# EAGLE design esquema (EAGLE 5.09)
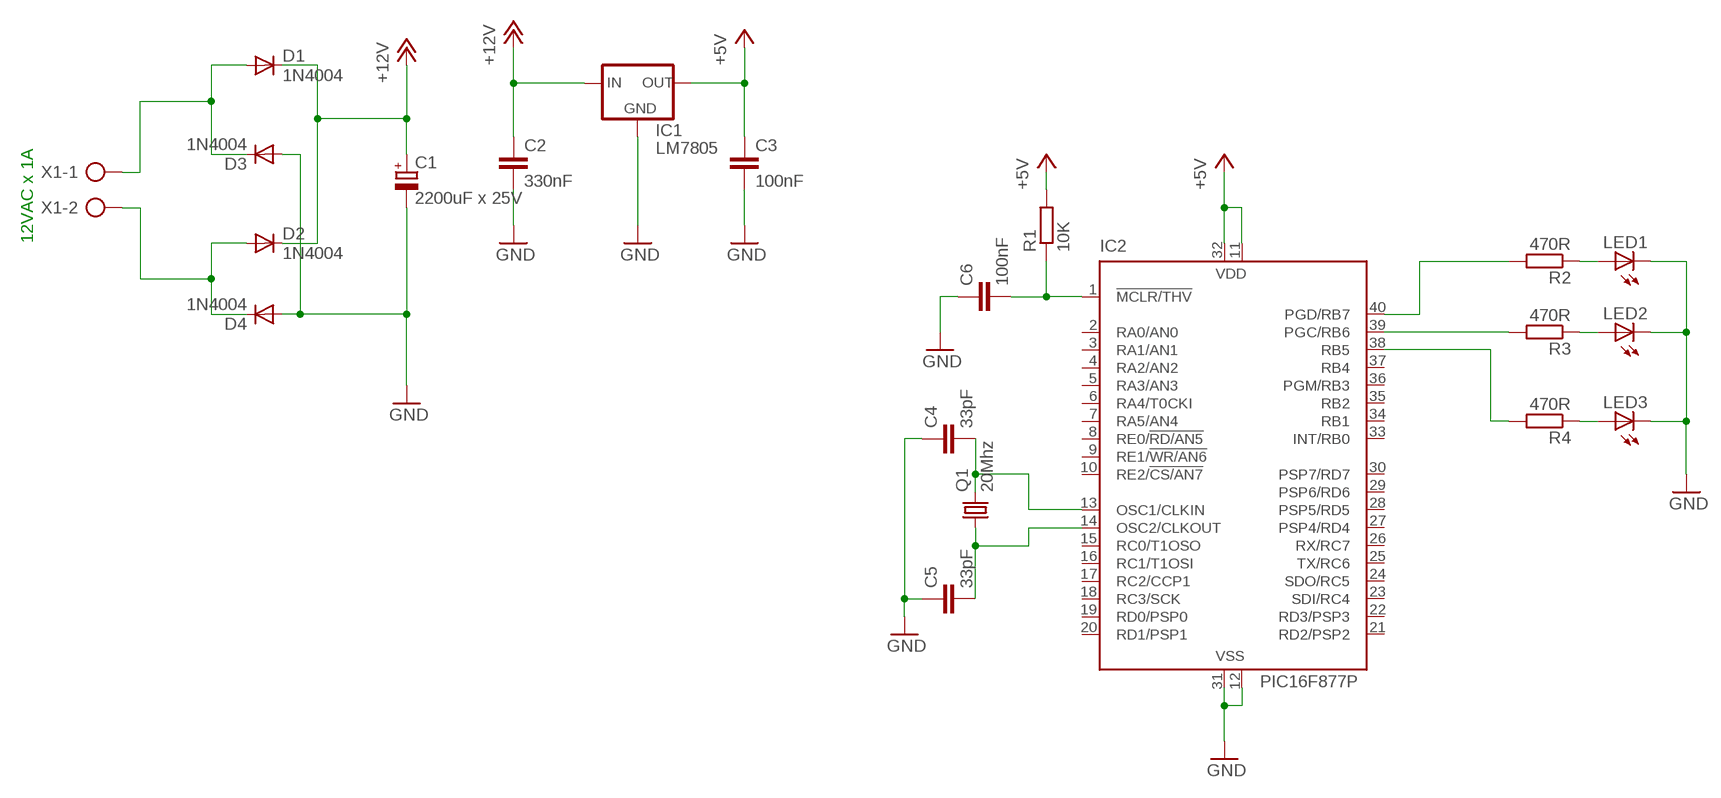
[diagram p0: schematic, sheet 1]

## Parts
C1  2200uF x 25V  CPOL-EUE7.5-16  [E7,5-16]
C2  330nF  C-EU050-030X075  [C050-030X075]
C3  100nF  C-EU050-030X075  [C050-030X075]
C4  33pF  C-EU050-030X075  [C050-030X075]
C5  33pF  C-EU050-030X075  [C050-030X075]
C6  100nF  C-EU050-030X075  [C050-030X075]
D1  1N4004  [DO41-10]
D2  1N4004  [DO41-10]
D3  1N4004  [DO41-10]
D4  1N4004  [DO41-10]
IC1  LM7805  78XXL  [78XXL]
IC2  PIC16F877P  [DIL40]
LED1  LEDB152  [Q62902-B152]
LED2  LEDB152  [Q62902-B152]
LED3  LEDB152  [Q62902-B152]
Q1  20Mhz  CRYSTALHC49S  [HC49/S]
R1  10K  R-EU_0207/10  [0207/10]
R2  470R  R-EU_0207/10  [0207/10]
R3  470R  R-EU_0207/10  [0207/10]
R4  470R  R-EU_0207/10  [0207/10]
X1  AK300/2  [AK300/2]

## Nets
+5V: C3.1 IC1.OUT IC2.11(VDD) IC2.32(VDD) R1.2
+12V: C1.+ C2.1 D1.C D2.C IC1.IN
GND: C1.- C2.2 C3.2 C4.1 C5.1 C6.1 D3.A D4.A IC1.GND IC2.12(VSS) IC2.31(VSS) LED1.K(C) LED2.K(C) LED3.K(C)
N$1: D1.A D3.C X1.1
N$2: D2.A D4.C X1.2
N$4: C6.2 IC2.1(!MCLR/THV) R1.1
N$5: C4.2 IC2.13(OSC1/CLKIN) Q1.2
N$6: C5.2 IC2.14(OSC2/CLKOUT) Q1.1
N$7: LED3.A R4.1
N$8: LED2.A R3.1
N$9: LED1.A R2.1
N$11: IC2.40(PGD/RB7) R2.2
N$12: IC2.39(PGC/RB6) R3.2
N$13: IC2.38(RB5) R4.2
Unconnected: IC2.2(RA0/AN0) IC2.3(RA1/AN1) IC2.4(RA2/AN2) IC2.5(RA3/AN3) IC2.6(RA4/T0CKI) IC2.7(RA5/AN4) IC2.8(RE0/!RD/AN5) IC2.9(RE1/!WR/AN6) IC2.10(RE2/!CS/AN7) IC2.15(RC0/T1OSO) IC2.16(RC1/T1OSI) IC2.17(RC2/CCP1) IC2.18(RC3/SCK) IC2.19(RD0/PSP0) IC2.20(RD1/PSP1) IC2.21(RD2/PSP2) IC2.22(RD3/PSP3) IC2.23(SDI/RC4) IC2.24(SDO/RC5) IC2.25(TX/RC6) IC2.26(RX/RC7) IC2.27(PSP4/RD4) IC2.28(PSP5/RD5) IC2.29(PSP6/RD6) IC2.30(PSP7/RD7) IC2.33(INT/RB0) IC2.34(RB1) IC2.35(RB2) IC2.36(PGM/RB3) IC2.37(RB4)

## Notes on the sheet
- 12VAC x 1A

## Library data of the parts
C1 = rcl:CPOL-EU: POLARIZED CAPACITOR, European symbol
C2-C6 = rcl:C-EU: CAPACITOR, European symbol
D1-D4 = diode:1N4004: DIODE general purpose rectifier, 1 A
IC1 = v-reg:78XXL: VOLTAGE REGULATOR
IC2 = microchip:PIC16F87*: MICROCONTROLLER
LED1-LED3 = led:LED: LED OSRAM: - CHIPLED LG R971, LG N971, LY N971, LG Q971, LY Q971, LO R971, LY R971 LH N974, LH R974 LS Q976, LO Q976, LY Q976 LO Q996 - Hyper CHIPLED LW Q18S LB Q993, LB Q99A, LB R99A - SideLED LS A670, LO A670, LY A670, LG A670, LP A670 LB A673, LV A673, LT A673, LW A673 LH A674 LY A675 LS A676, LA A676, LO A676, LY A676, LW A676 LS A679, LY A679, LG A679 - Hyper Micro SIDELED® LS Y876, LA Y876, LO Y876, LY Y876 LT Y87S - SmartLED LW L88C, LW L88S LB L89C, LB L89S, LG L890 LS L89K, LO L89K, LY L89K LS L896, LA L896, LO L896, LY L896 - TOPLED LS T670, LO T670, LY T670, LG T670, LP T670 LSG T670, LSP T670, LSY T670, LOP T670, LYG T670 LG T671, LOG T671, LSG T671 LB T673, LV T673, LT T673, LW T673 LH T674 LS T676, LA T676, LO T676, LY T676, LB T676, LH T676, LSB T676, LW T676 LB T67C, LV T67C, LT T67C, LS T67K, LO T67K, LY T67K, LW E67C LS E67B, LA E67B, LO E67B, LY E67B, LB E67C, LV E67C, LT E67C LW T67C LS T679, LY T679, LG T679 LS T770, LO T770, LY T770, LG T770, LP T770 LB T773, LV T773, LT T773, LW T773 LH T774 LS E675, LA E675, LY E675, LS T675 LS T776, LA T776, LO T776, LY T776, LB T776 LHGB T686 LT T68C, LB T68C - Hyper Mini TOPLED® LB M676 - Mini TOPLED Santana® LG M470 LS M47K, LO M47K, LY M47K Source: http://www.osram.convergy.de LUXEON: - LUMILED® LXK2-PW12-R00, LXK2-PW12-S00, LXK2-PW14-U00, LXK2-PW14-V00 LXK2-PM12-R00, LXK2-PM12-S00, LXK2-PM14-U00 LXK2-PE12-Q00, LXK2-PE12-R00, LXK2-PE12-S00, LXK2-PE14-T00, LXK2-PE14-U00 LXK2-PB12-K00, LXK2-PB12-L00, LXK2-PB12-M00, LXK2-PB14-N00, LXK2-PB14-P00, LXK2-PB14-Q00 LXK2-PR12-L00, LXK2-PR12-M00, LXK2-PR14-Q00, LXK2-PR14-R00 LXK2-PD12-Q00, LXK2-PD12-R00, LXK2-PD12-S00 LXK2-PH12-R00, LXK2-PH12-S00 LXK2-PL12-P00, LXK2-PL12-Q00, LXK2-PL12-R00 Source: www.luxeon.com KINGBRIGHT: KA-3528ASYC Source: www.kingbright.com
Q1 = crystal:CRYSTAL: CRYSTAL
R1-R4 = rcl:R-EU_: RESISTOR, European symbol
X1 = con-ptr500:AK300/2: CONNECTOR

## Board
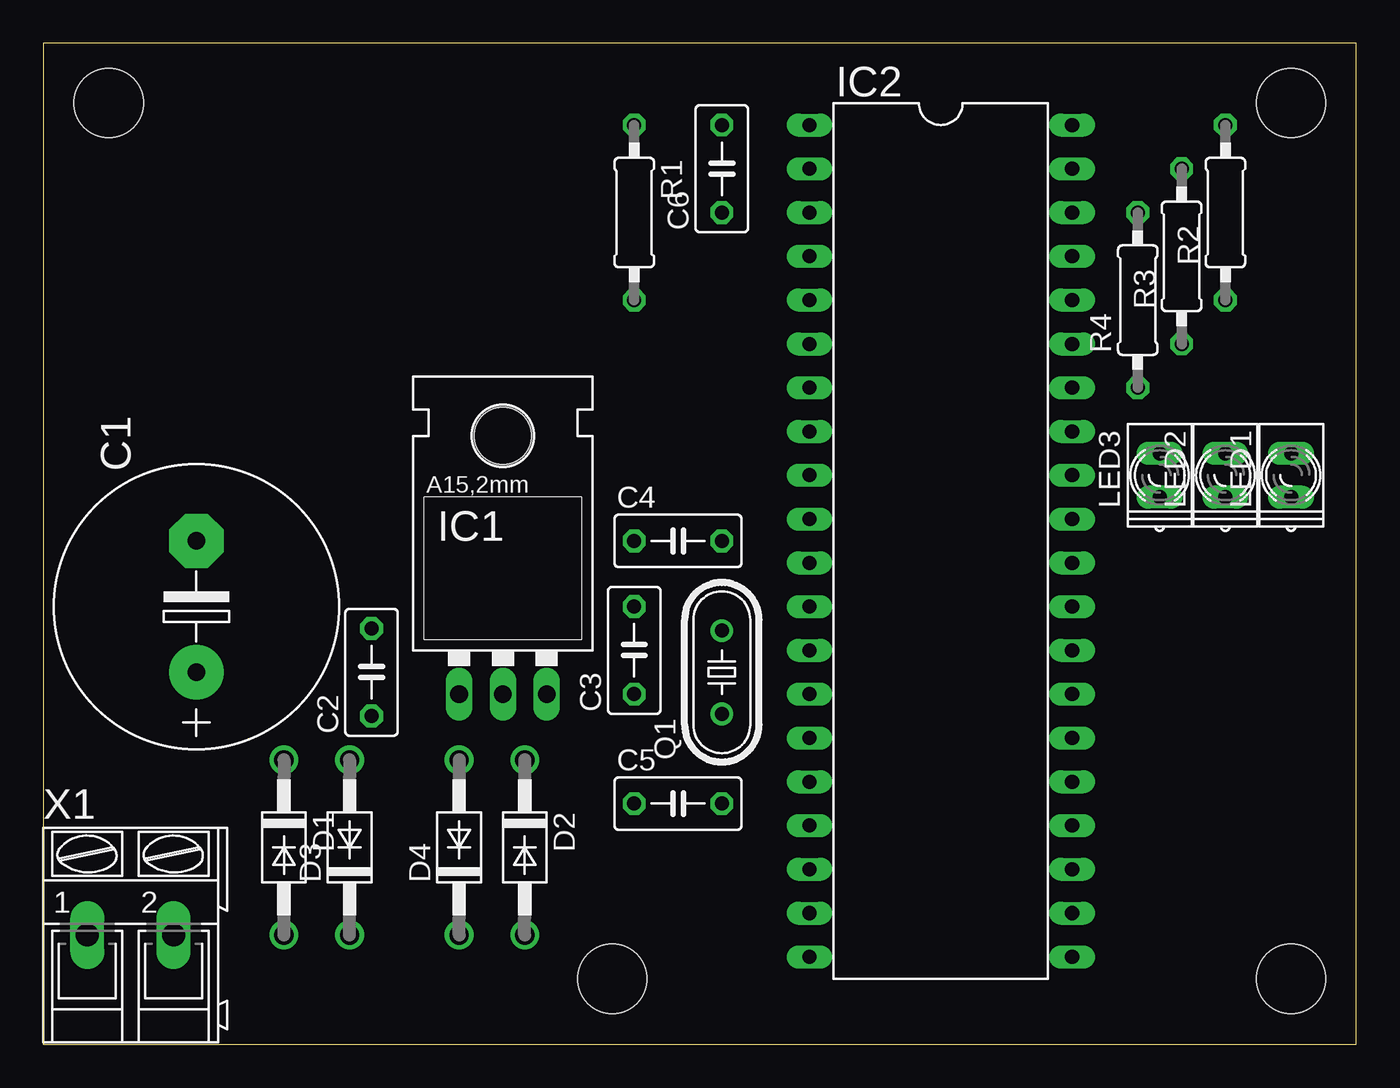
[diagram p1: board, top side]
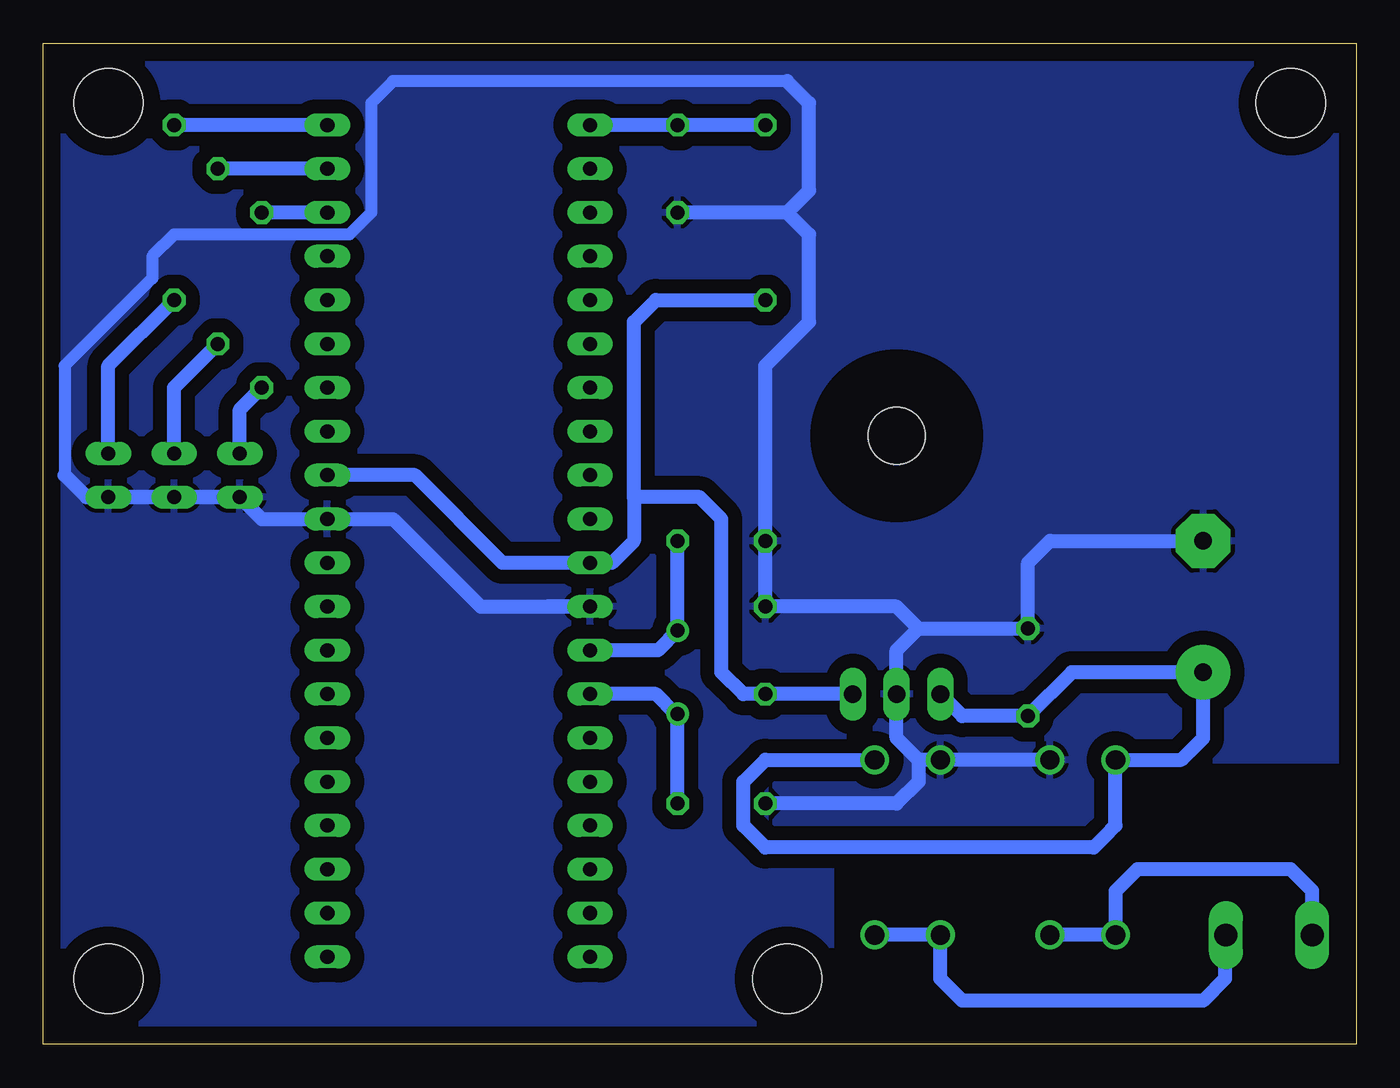
[diagram p2: board, bottom side, seen from below]

Size 76.18 x 58.09 mm. Coordinates in mm from the lower left corner, seen from the top.
Outline: 0,0 76.18,0 76.18,58.09 0,58.09 0,0
Copper layers (1*16): Top 0.035mm / dielectric 1.5mm / Bottom 0.035mm
Design rules "default": minimum track width 10mil, minimum drill 24mil, track to track 8mil, track to pad 8mil, pad to pad 8mil, via to via 8mil, smd to smd 8mil, copper to edge 40mil, drill to drill 8mil, minimum pad ring 10mil, minimum via ring 8mil, stop-mask expansion 4mil, vias tented up to drill 0mil, thermal gap 10mil
Holes 4 mm at 3.81,54.61 72.39,54.61 72.39,3.81 33.02,3.81

### Footprints (pad centres in the part's own frame; a part is rotated, then mirrored left to right if it is on the bottom)
E7,5-16 = drill 1.016 pad 3.15 round: + -3.81,0 | drill 1.016 pad 3.15 octagon: - 3.81,0
C050-030X075 = drill 0.813 octagon: 1 -2.54,0; 2 2.54,0
DO41-10 = drill 1.118 round: A 5.08,0; C -5.08,0
78XXL = drill 1.016 long: GND 0,-3.81; IN -2.54,-3.81; OUT 2.54,-3.81 | hole 3.302: 0,11.176
DIL40 = drill 0.813 long: 1 -24.13,-7.62; 2 -21.59,-7.62; 3 -19.05,-7.62; 4 -16.51,-7.62; 5 -13.97,-7.62; 6 -11.43,-7.62; 7 -8.89,-7.62; 8 -6.35,-7.62; 9 -3.81,-7.62; 10 -1.27,-7.62; 11 1.27,-7.62; 12 3.81,-7.62; 13 6.35,-7.62; 14 8.89,-7.62; 15 11.43,-7.62; 16 13.97,-7.62; 17 16.51,-7.62; 18 19.05,-7.62; 19 21.59,-7.62; 20 24.13,-7.62; 21 24.13,7.62; 22 21.59,7.62; 23 19.05,7.62; 24 16.51,7.62; 25 13.97,7.62; 26 11.43,7.62; 27 8.89,7.62; 28 6.35,7.62; 29 3.81,7.62; 30 1.27,7.62; 31 -1.27,7.62; 32 -3.81,7.62; 33 -6.35,7.62; 34 -8.89,7.62; 35 -11.43,7.62; 36 -13.97,7.62; 37 -16.51,7.62; 38 -19.05,7.62; 39 -21.59,7.62; 40 -24.13,7.62
Q62902-B152 = drill 0.813 long: A 1.27,0; K -1.27,0
HC49/S = drill 0.813 round: 1 -2.413,0; 2 2.413,0
0207/10 = drill 0.813 octagon: 1 -5.08,0; 2 5.08,0
AK300/2 = drill 1.321 long: 1 -2.515,0; 2 2.489,0

### Placement (x,y rotation side)
C1  8.89,25.4 90 top
C2  19.05,21.59 90 top
C3  34.29,22.86 90 top
C4  36.83,29.21 0 top
C5  36.83,13.97 0 top
C6  39.37,50.8 90 top
D1  13.97,11.43 270 top
D2  27.94,11.43 270 top
D3  17.78,11.43 90 top
D4  24.13,11.43 90 top
IC1  26.67,24.13 0 top
IC2  52.07,29.21 270 top
LED1  72.39,33.02 90 top
LED2  68.58,33.02 90 top
LED3  64.77,33.02 90 top
Q1  39.37,21.59 90 top
R1  34.29,48.26 270 top
R2  68.58,48.26 90 top
R3  66.04,45.72 90 top
R4  63.5,43.18 90 top
X1  5.08,6.35 0 top

### Tracks (layer width: path | path; a pad name or v marks a point on that pad's centre or on a via)
+5V
  Bottom 0.813: IC1.OUT C3.1 35.56,20.32 36.83,21.59 36.83,30.48 38.1,31.75 41.91,31.75 | IC2.32 54.61,33.02 49.53,27.94 IC2.11 43.18,27.94 41.91,29.21 41.91,31.75 | 41.91,31.75 41.91,41.91 40.64,43.18 R1.2
+12V
  Bottom 0.813: IC1.IN 22.86,19.05 C2.1 16.51,21.59 C1.+ 8.89,17.78 10.16,16.51 D1.C 13.97,12.7 14.61,12.06 15.24,11.43 34.29,11.43 35.56,12.7 35.56,15.24 34.29,16.51 D2.C
GND
  Bottom 0.7: 33.02,55.88 55.88,55.88 57.15,54.61 57.15,48.26 58.42,46.99 68.58,46.99 69.85,45.72 69.85,44.45 74.93,39.37 74.93,33.02
  Bottom 0.813: D3.A D4.A 25.4,16.51 | 25.4,16.51 26.67,17.78 IC1.GND 26.67,22.86 25.4,24.13 | 25.4,24.13 C2.2 19.05,27.94 17.78,29.21 C1.- | 25.4,24.13 26.67,25.4 C3.2 C4.1 34.29,39.37 31.75,41.91 31.75,46.99 33.02,48.26 | C5.1 26.67,13.97 25.4,15.24 25.4,16.51 | 33.02,48.26 C6.1 | 46.99,25.4 IC2.12 50.8,25.4 55.88,30.48 IC2.31 63.5,30.48 LED3.K | LED3.K LED2.K LED1.K | LED3.K 73.66,31.75 74.93,33.02 | 33.02,55.88 31.75,54.61 31.75,49.53 33.02,48.26
  pour Bottom (isolate 0.813): 76.2,57.15 76.2,0 30.48,0 30.48,11.43 13.97,11.43 13.97,16.51 0,16.51 0,57.15 0,58.42 76.2,58.42
N$1
  Bottom 0.813: D3.C D1.A 13.97,8.89 12.7,10.16 3.81,10.16 2.56,8.91 X1.1
N$2
  Bottom 0.813: X1.2 7.62,6.35 7.62,3.81 8.89,2.54 22.86,2.54 24.13,3.81 D4.C D2.A
N$4
  Bottom 0.813: R1.1 C6.2 IC2.1
N$5
  Bottom 0.813: IC2.13 40.51,22.86 Q1.2 C4.2
N$6
  Bottom 0.813: IC2.14 40.64,20.32 39.5,19.18 Q1.1 C5.2
N$7
  Bottom 0.813: LED3.A 64.77,36.83 R4.1
N$8
  Bottom 0.813: LED2.A 68.58,38.1 R3.1
N$9
  Bottom 0.813: LED1.A 72.39,39.37 R2.1
N$11
  Bottom 0.813: IC2.40 R2.2
N$12
  Bottom 0.813: IC2.39 R3.2
N$13
  Bottom 0.813: IC2.38 R4.2